# EAGLE design Power Switching Circuit rev4 (EAGLE 9.6.2)

## Sheet 1 of 2
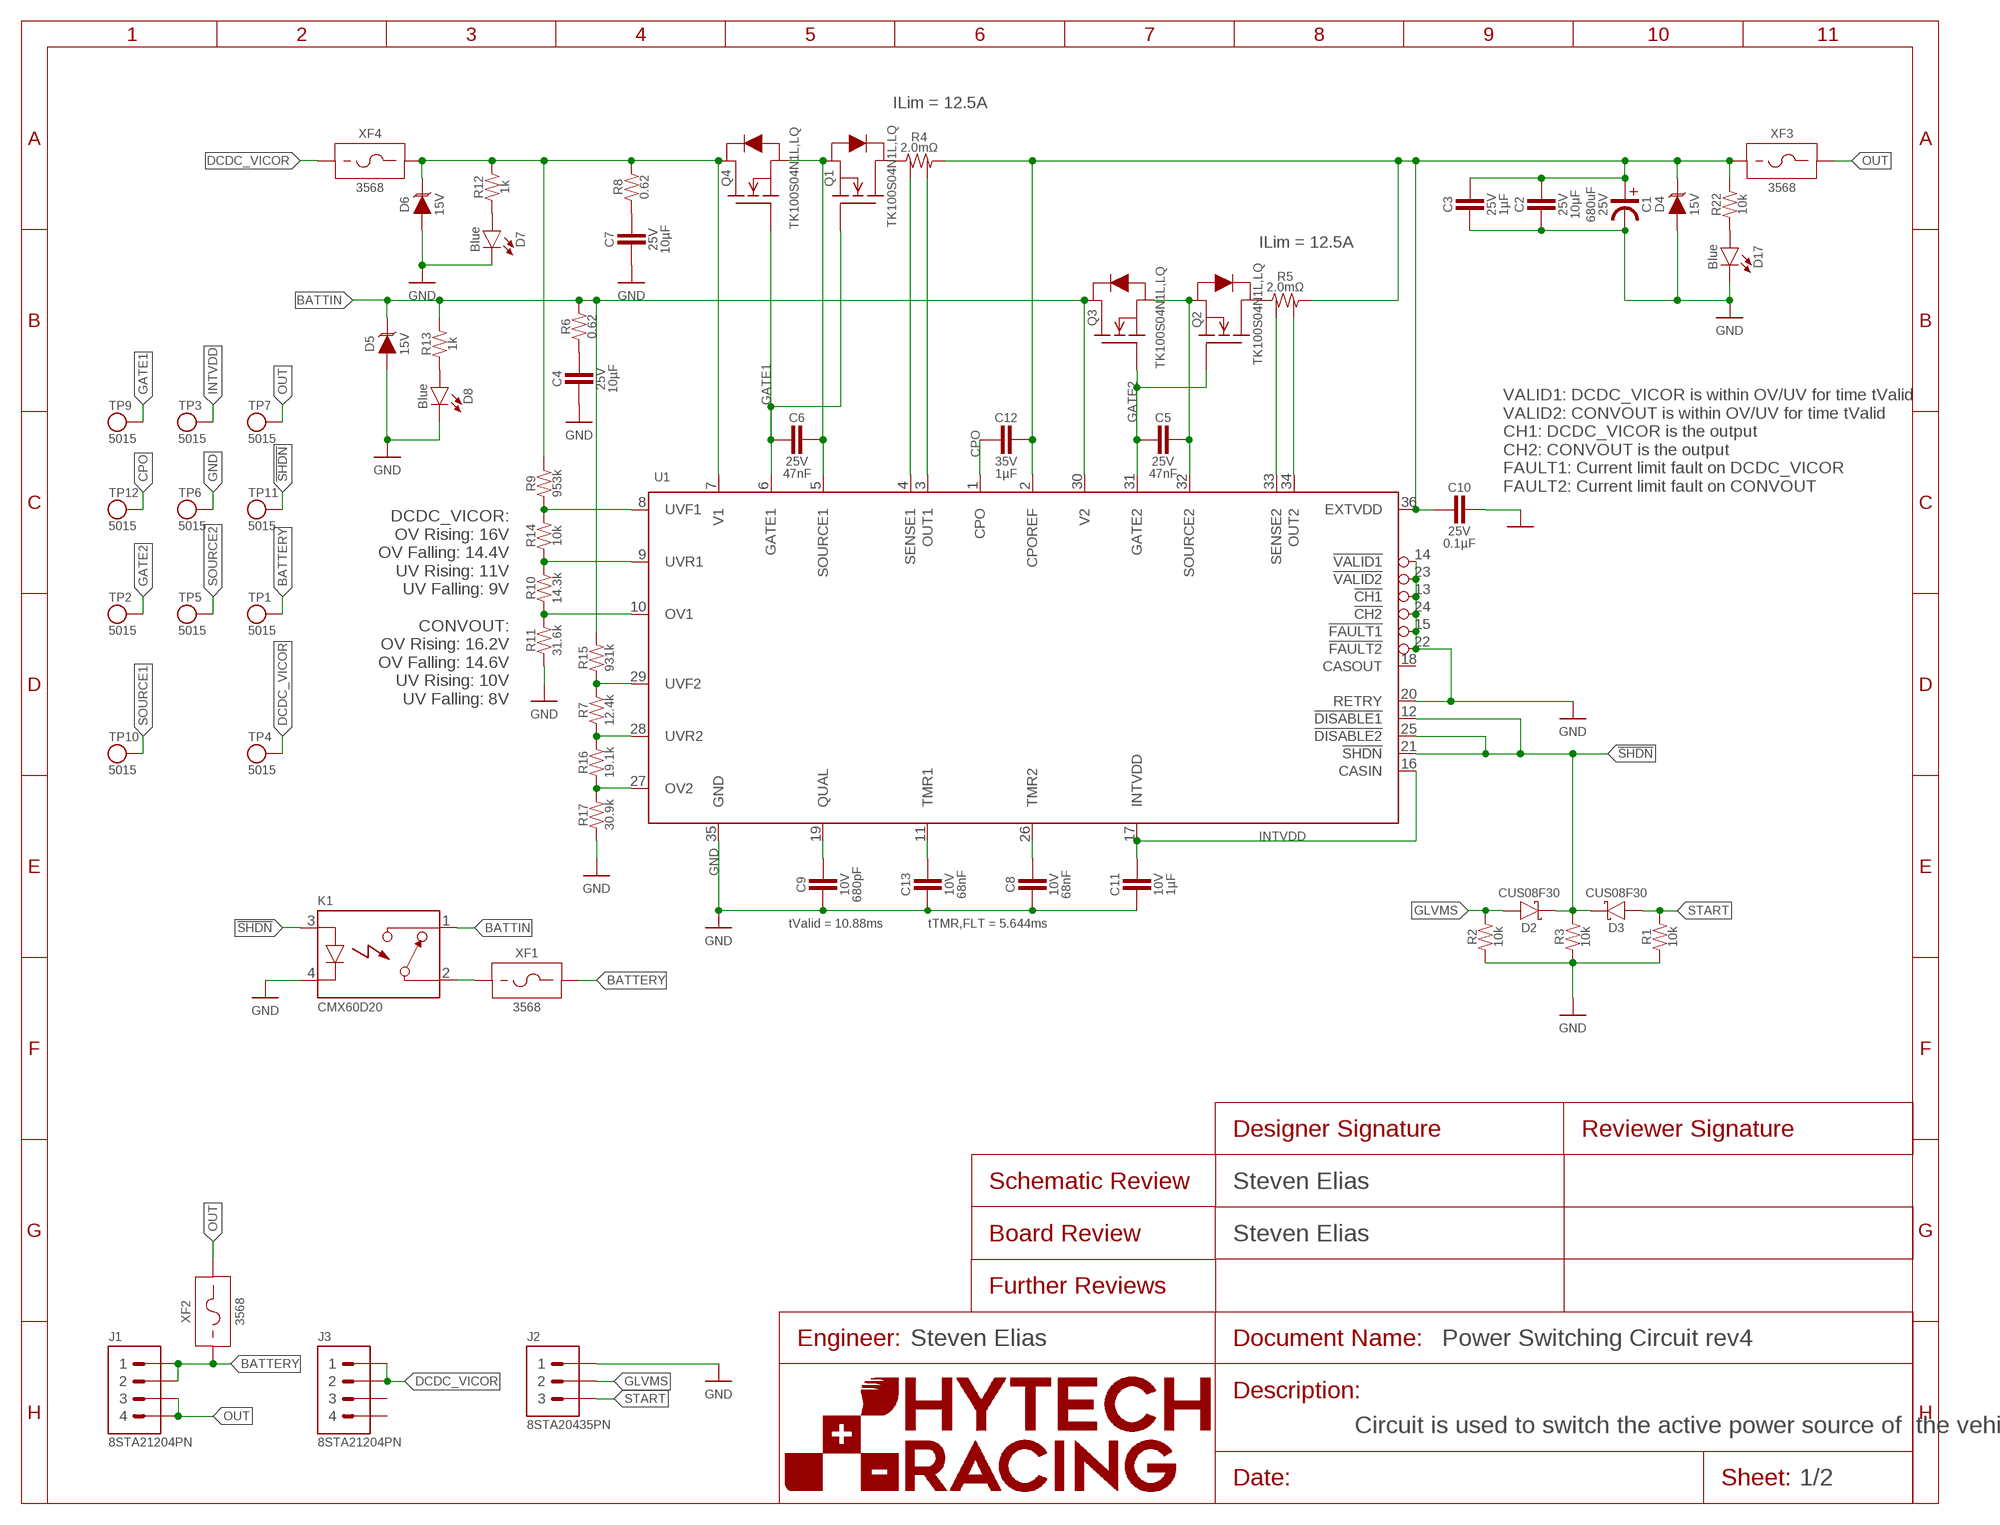
[diagram p0: schematic, sheet 1]
FRAME1 (FRAME): DESCRIPTION_1: Circuit is used to switch the active power source of the vehicle from the GLV battery to the accumulator; DESIGNER_BOARD: Steven Elias; DESIGNER_SCHEMATIC: Steven Elias; ENGINEER: Steven Elias

### Parts
C1  EEUFP1E681  [EEUFP1E*]
C2  CAPACITOR_0603_25V_10UF  [0603-CAP]
C3  CAPACITOR_0603_25V_1UF  [0603-CAP]
C4  CAPACITOR_0603_25V_10UF  [0603-CAP]
C5  CAPACITOR_0603_25V_47NF  [0603-CAP]
C6  CAPACITOR_0603_25V_47NF  [0603-CAP]
C7  CAPACITOR_0603_25V_10UF  [0603-CAP]
C8  CAPACITOR_0603_10V_68NF  [0603-CAP]
C9  CAPACITOR_0603_10V_680PF  [0603-CAP]
C10  CAPACITOR_0603_25V_0.1UF  [0603-CAP]
C11  CAPACITOR_0603_10V_1UF  [0603-CAP]
C12  CAPACITOR_0603_35V_1UF  [0603-CAP]
C13  CAPACITOR_0603_10V_68NF  [0603-CAP]
D2  SCHOTTKY_SOD323_30V  [SOD-323]
D3  SCHOTTKY_SOD323_30V  [SOD-323]
D4  TVS_15V  [SOT-23]
D5  TVS_15V  [SOT-23]
D6  TVS_15V  [SOT-23]
D7  LED_0603_BLUE  [0603-LED]
D8  LED_0603_BLUE  [0603-LED]
D17  LED_0603_BLUE  [0603-LED]
J1  CONNECTOR-4_SOURIAU_  [SOURIAU_12-04]
J2  CONNECTOR-3_8STA20435PN  [SOURIAU_04-35]
J3  CONNECTOR-4_SOURIAU_  [SOURIAU_12-04]
K1  RELAY_SOLIDSTATE_NO_CMX60D20  [CRYDOM_CMX]
Q1  TRANSISTOR_N_MOS_2-7K1S_TK100S04N1LLQ  [DPAK(2-7K1S)]
Q2  TRANSISTOR_N_MOS_2-7K1S_TK100S04N1LLQ  [DPAK(2-7K1S)]
Q3  TRANSISTOR_N_MOS_2-7K1S_TK100S04N1LLQ  [DPAK(2-7K1S)]
Q4  TRANSISTOR_N_MOS_2-7K1S_TK100S04N1LLQ  [DPAK(2-7K1S)]
R1  RESISTOR_0603_10K  [0603-RES]
R2  RESISTOR_0603_10K  [0603-RES]
R3  RESISTOR_0603_10K  [0603-RES]
R4  RESISTOR_SENSE__WSL40262L000FEB  [4026]
R5  RESISTOR_SENSE__WSL40262L000FEB  [4026]
R6  RESISTOR_0805_0.62  [0805-RES]
R7  RESISTOR_0603_12.4K  [0603-RES]
R8  RESISTOR_0805_0.62  [0805-RES]
R9  RESISTOR_0805_953K  [0805-RES]
R10  RESISTOR_0805_14.3K  [0805-RES]
R11  RESISTOR_0805_31.6K  [0805-RES]
R12  RESISTOR_0603_1K  [0603-RES]
R13  RESISTOR_0603_1K  [0603-RES]
R14  RESISTOR_0603_10K  [0603-RES]
R15  RESISTOR_0805_931K  [0805-RES]
R16  RESISTOR_0805_19.1K  [0805-RES]
R17  RESISTOR_0603_30.9K  [0603-RES]
R22  RESISTOR_0603_10K  [0603-RES]
TP1  TEST_POINT  [5015]
TP2  TEST_POINT  [5015]
TP3  INTVDD  TEST_POINT  [5015]
TP4  TEST_POINT  [5015]
TP5  TEST_POINT  [5015]
TP6  TEST_POINT  [5015]
TP7  TEST_POINT  [5015]
TP9  TEST_POINT  [5015]
TP10  TEST_POINT  [5015]
TP11  TEST_POINT  [5015]
TP12  TEST_POINT  [5015]
U1  LTC4421  [SSOP-36]
XF1  FUSE_HOLDER_MINIBLADEPTH  [3568]
XF2  FUSE_HOLDER_MINIBLADEPTH  [3568]
XF3  FUSE_HOLDER_MINIBLADEPTH  [3568]
XF4  FUSE_HOLDER_MINIBLADEPTH  [3568]

### Nets
!SHDN: D2.C D3.C K1.3(CONTROL+) R3.2 TP11.1 U1.12(!DISABLE1) U1.21(!SHDN) U1.25(!DISABLE2)
BATTERY: J1.1 J1.2 TP1.1 XF1.3 XF1.4 XF2.1 XF2.2
BATTIN: D5.3(C) K1.1(CONTACT2) Q3.2(D) R6.2 R13.2 R15.2 U1.30(V2)
CPO: C12.2 TP12.1 U1.1(CPO)
DCDC_VICOR: J3.1 J3.2 TP4.1 XF4.1 XF4.2
DCDC_VICORPREMOS: D6.3(C) Q4.2(D) R8.2 R9.2 R12.2 U1.7(V1) XF4.3 XF4.4
GATE1: C6.2 Q1.1(G) Q4.1(G) TP9.1 U1.6(GATE1)
GATE2: C5.2 Q2.1(G) Q3.1(G) TP2.1 U1.31(GATE2)
GLVMS: D2.A J2.B R2.2
GND: C1.P$2(MINUS) C2.2 C3.2 C4.2 C7.2 C8.2 C9.2 C10.1 C11.2 C13.2 D4.1(A) D5.1(A) D6.1(A) D7.1(C) D8.1(C) D17.1(C) J2.A K1.4(CONTROL-) R1.1 R2.1 R3.1 R11.1 R17.1 TP6.1 U1.13(!CH1) U1.14(!VALID1) U1.15(!FAULT1) U1.20(RETRY) U1.22(!FAULT2) U1.23(!VALID2) U1.24(!CH2) U1.35(GND)
INTVDD: C11.1 TP3.1 U1.16(CASIN) U1.17(INTVDD)
N$1: C9.1 U1.19(QUAL)
N$2: C13.1 U1.11(TMR1)
N$3: C8.1 U1.26(TMR2)
N$4: C4.1 R6.1
N$5: D17.2(A) R22.1
N$6: D8.2(A) R13.1
N$7: D7.2(A) R12.1
N$12: K1.2(CONTACT1) XF1.1 XF1.2
N$18: R5.3 U1.33(SENSE2)
N$20: R5.4 U1.34(OUT2)
N$22: C7.1 R8.1
N$23: R4.3 U1.4(SENSE1)
N$24: R10.2 R14.1 U1.9(UVR1)
N$25: R10.1 R11.2 U1.10(OV1)
N$26: R7.2 R15.1 U1.29(UVF2)
N$27: R7.1 R16.2 U1.28(UVR2)
N$28: R16.1 R17.2 U1.27(OV2)
N$30: Q2.2(D) R5.1
N$31: R4.4 U1.3(OUT1)
N$33: Q1.2(D) R4.1
OUT: J1.3 J1.4 TP7.1 XF2.3 XF2.4 XF3.3 XF3.4
OUTPREFUSE: C1.P$1(PLUS) C2.1 C3.1 C10.2 C12.1 D4.3(C) R4.2 R5.2 R22.2 U1.2(CPOREF) U1.36(EXTVDD) XF3.1 XF3.2
SOURCE1: C6.1 Q1.3(S) Q4.3(S) TP10.1 U1.5(SOURCE1)
SOURCE2: C5.1 Q2.3(S) Q3.3(S) TP5.1 U1.32(SOURCE2)
START: D3.A J2.C R1.2
UVF1: R9.1 R14.2 U1.8(UVF1)
Unconnected: J3.3 J3.4 U1.18(CASOUT)

### Notes on the sheet
- ILim = 12.5A
- ILim = 12.5A
- VALID1: DCDC_VICOR is within OV/UV for time tValid
  VALID2: CONVOUT is within OV/UV for time tValid
  CH1: DCDC_VICOR is the output
  CH2: CONVOUT is the output
  FAULT1: Current limit fault on DCDC_VICOR
  FAULT2: Current limit fault on CONVOUT
- DCDC_VICOR:
  OV Rising: 16V
  OV Falling: 14.4V
  UV Rising: 11V
  UV Falling: 9V
  
  CONVOUT:
  OV Rising: 16.2V
  OV Falling: 14.6V
  UV Rising: 10V
  UV Falling: 8V
- tValid = 10.88ms | tTMR,FLT = 5.644ms

## Sheet 2 of 2
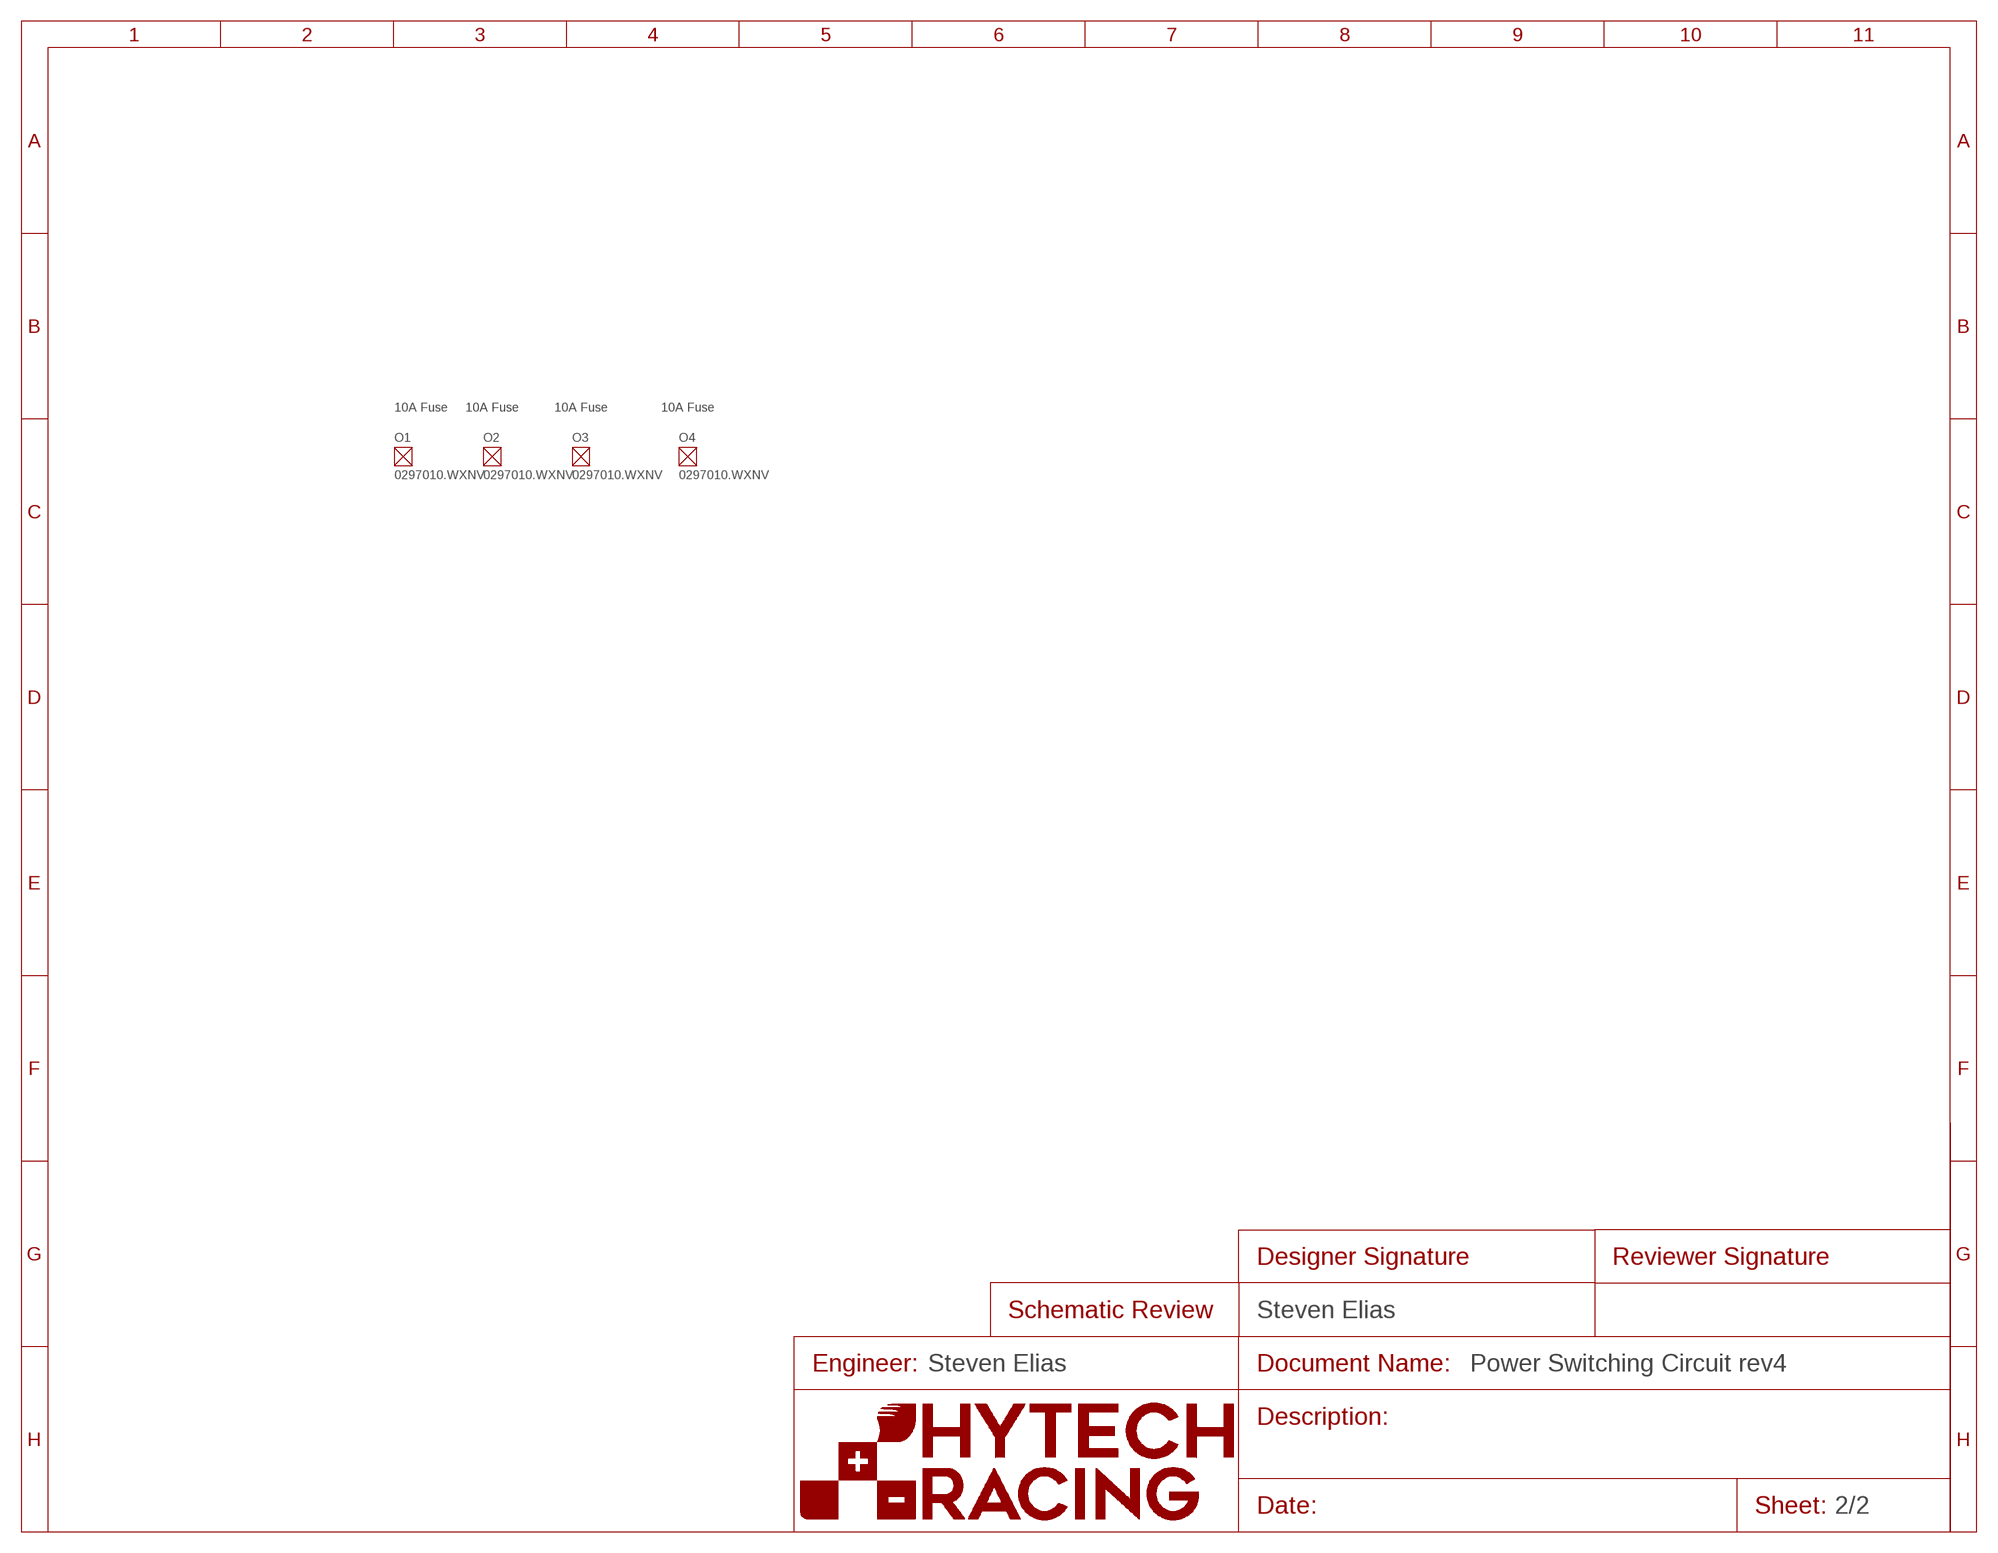
[diagram p1: schematic, sheet 2]
FRAME2 (FRAME_SCHEMATIC_ONLY): DESIGNER_SCHEMATIC: Steven Elias; ENGINEER: Steven Elias
O1 (FUSE_MINI_BLADE_10): DKPN: F991-ND; MANUFACTURER: Littelfuse Inc.; MOPN: 576-0297010.WXNV; MPN: 0297010.WXNV
O2 (FUSE_MINI_BLADE_10): DKPN: F991-ND; MANUFACTURER: Littelfuse Inc.; MOPN: 576-0297010.WXNV; MPN: 0297010.WXNV
O3 (FUSE_MINI_BLADE_10): DKPN: F991-ND; MANUFACTURER: Littelfuse Inc.; MOPN: 576-0297010.WXNV; MPN: 0297010.WXNV
O4 (FUSE_MINI_BLADE_10): DKPN: F991-ND; MANUFACTURER: Littelfuse Inc.; MOPN: 576-0297010.WXNV; MPN: 0297010.WXNV

### Notes on the sheet
- 10A Fuse | 10A Fuse | 10A Fuse | 10A Fuse

## Library data of the parts
C1 = HyTechDevicesTemp:EEUFP1E*: EEUFP1E Aluminum Electrolytic Capacitor Datasheet <https://www.mouser.com/datasheet/2/315/RDF0000C1260-1391675.pdf>; CAPACITANCE: 680uF; DKPN: P123947-ND; ESR: 0.068; MANUFACTURER: Panasonic Electronic Components; MOPN: 667-EEU-FP1E681; MPN: EEU-FP1E681; TOLERANCE: 20%; VOLTAGE: 25V
C2 C4 C7 = HyTechDevices:CAPACITOR_?_*: Capacitor, Non-Polarized VJ...1BC Series Datasheet Samsung Datasheet Walsin Datasheet GRM188R61A226ME15D GRM188R61E106MA73D 885012006013 2220Y6300105KXTWS2 Yageo Class 2, X5R TDK C Series AVX Automotive MLCC KEMET X7R Series Kyocera AVX; CAPACITANCE: 10µF; DKPN: 490-7202-1-ND; MANUFACTURER: Murata Electronics; MOPN: 81-GRM188R61E106MA3D; MPN: GRM188R61E106MA73D; TOLERANCE: 20%; VOLTAGE: 25V
C3 = HyTechDevices:CAPACITOR_?_*: Capacitor, Non-Polarized VJ...1BC Series Datasheet Samsung Datasheet Walsin Datasheet GRM188R61A226ME15D GRM188R61E106MA73D 885012006013 2220Y6300105KXTWS2 Yageo Class 2, X5R TDK C Series AVX Automotive MLCC KEMET X7R Series Kyocera AVX; CAPACITANCE: 1µF; DKPN: 1276-1184-1-ND; MANUFACTURER: Samsung Electro-Mechanics; MOPN: 187-CL10B105KA8NNNC; MPN: CL10B105KA8NNNC; TOLERANCE: 10%; VOLTAGE: 25V
C5 C6 = HyTechDevices:CAPACITOR_?_*: Capacitor, Non-Polarized VJ...1BC Series Datasheet Samsung Datasheet Walsin Datasheet GRM188R61A226ME15D GRM188R61E106MA73D 885012006013 2220Y6300105KXTWS2 Yageo Class 2, X5R TDK C Series AVX Automotive MLCC KEMET X7R Series Kyocera AVX; CAPACITANCE: 47nF; DKPN: 478-6340-1-ND; MANUFACTURER: Kyocera AVX; MOPN: 581-06033C473K42ZA; MPN: 06033C473K4Z2A; TOLERANCE: 10%; VOLTAGE: 25V
C8 C13 = HyTechDevices:CAPACITOR_?_*: Capacitor, Non-Polarized VJ...1BC Series Datasheet Samsung Datasheet Walsin Datasheet GRM188R61A226ME15D GRM188R61E106MA73D 885012006013 2220Y6300105KXTWS2 Yageo Class 2, X5R TDK C Series AVX Automotive MLCC KEMET X7R Series Kyocera AVX; CAPACITANCE: 68nF; DKPN: 399-C0603C683K8RAC7867CT-ND; MANUFACTURER: KEMET; MOPN: 80-C0603C683K8R; MPN: C0603C683K8RACTU; TOLERANCE: 10%; VOLTAGE: 10V
C9 = HyTechDevices:CAPACITOR_?_*: Capacitor, Non-Polarized VJ...1BC Series Datasheet Samsung Datasheet Walsin Datasheet GRM188R61A226ME15D GRM188R61E106MA73D 885012006013 2220Y6300105KXTWS2 Yageo Class 2, X5R TDK C Series AVX Automotive MLCC KEMET X7R Series Kyocera AVX; CAPACITANCE: 680pF; DKPN: 732-7757-1-ND; MANUFACTURER: Würth Elektronik; MOPN: 710-885012006013; MPN: 885012006013; TOLERANCE: 5%; VOLTAGE: 10V
C10 = HyTechDevices:CAPACITOR_?_*: Capacitor, Non-Polarized VJ...1BC Series Datasheet Samsung Datasheet Walsin Datasheet GRM188R61A226ME15D GRM188R61E106MA73D 885012006013 2220Y6300105KXTWS2 Yageo Class 2, X5R TDK C Series AVX Automotive MLCC KEMET X7R Series Kyocera AVX; CAPACITANCE: 0.1µF; DKPN: 1276-1006-1-ND; MANUFACTURER: Samsung Electro-Mechanics; MOPN: 187-CL10B104KA8NNNC; MPN: CL10B104KA8NNNC; TOLERANCE: 10%; VOLTAGE: 25V
C11 = HyTechDevices:CAPACITOR_?_*: Capacitor, Non-Polarized VJ...1BC Series Datasheet Samsung Datasheet Walsin Datasheet GRM188R61A226ME15D GRM188R61E106MA73D 885012006013 2220Y6300105KXTWS2 Yageo Class 2, X5R TDK C Series AVX Automotive MLCC KEMET X7R Series Kyocera AVX; CAPACITANCE: 1µF; DKPN: 311-1796-1-ND; MANUFACTURER: Yageo; MOPN: 603-CC603KRX7R6BB105; MPN: CC0603KRX7R6BB105; TOLERANCE: 10%; VOLTAGE: 10V
C12 = HyTechDevices:CAPACITOR_?_*: Capacitor, Non-Polarized VJ...1BC Series Datasheet Samsung Datasheet Walsin Datasheet GRM188R61A226ME15D GRM188R61E106MA73D 885012006013 2220Y6300105KXTWS2 Yageo Class 2, X5R TDK C Series AVX Automotive MLCC KEMET X7R Series Kyocera AVX; CAPACITANCE: 1µF; DKPN: 445-173625-1-ND; MANUFACTURER: TDK Corporation; MOPN: 810-C1608X7R1V105KAE; MPN: C1608X7R1V105K080AE; TOLERANCE: 10%; VOLTAGE: 35V
D2 D3 = HyTechDevices:SCHOTTKY_?_*: CUS08F30 Shottky Diode Datasheet; CURRENT: 0.8A; DKPN: CUS08F30H3FTR-ND; MANUFACTURER: Toshiba Semiconductor and Storage; MOPN: 757-CUS08F30H3F; MPN: CUS08F30; VOLTAGE: 30V
D4-D6 = HyTechDevices:TVS_*: TVS Diode GSOT Datasheet; DKPN: GSOT15-E3-08CT-ND; MANUFACTURER: Vishay General Semiconductor - Diodes Division; MOPN: 78-GSOT15-E3-08; MPN: GSOT15-E3-08; VOLTAGE: 15V
D7 D8 D17 = HyTechDevices:LED_?_*: LED 0603 Blue Green Orange Red White Yellow 2835 (Series not on Digikey) Lumiled LUXEON 2835 Color Line; COLOR: Blue; DKPN: 754-1789-1-ND; MANUFACTURER: Kingbright; MOPN: 604-APT1608VBC/D; MPN: APT1608VBC/D
J1 J3 = HyTechDevices:CONNECTOR-4_?_*; MANUFACTURER: Souriau; MPN: 8STA21204PN
J2 = HyTechDevices:CONNECTOR-3_?; MANUFACTURER: Souriau; MPN: 8STA20435PN
K1 = HyTechDevicesTemp:RELAY_SOLIDSTATE_NO_?*: Solid State Normally Open Relay Crydom CMX Series <https://www.mouser.com/datasheet/2/657/cmx_series_dc_pcb_mount-1370813.pdf>; DKPN: CC1666-ND; MANUFACTURER: Crydom; MOPN: 558-CMX60D20; MPN: CMX60D20
Q1-Q4 = HyTechDevices:TRANSISTOR_N_MOS_?_*: N-MOSFET PMV15ENEA Datasheet TK6P65W Datasheet SIR638ADP Datasheet; DKPN: TK100S04N1LLQCT-ND; MANUFACTURER: Toshiba Semiconductor and Storage; MOPN: 757-TK100S04N1LLQ; MPN: TK100S04N1L,LQ
R1-R3 R14 R22 = HyTechDevices:RESISTOR_?_*: Resistor PWR163 Series <https://www.mouser.com/datasheet/2/54/pwr163-777985.pdf> AC Series <https://www.mouser.com/datasheet/2/447/Yageo_PYu_AC_51_RoHS_L_7_1714230-1874691.pdf> PU Series <https://www.mouser.com/datasheet/2/447/PYu-PU_51_RoHS_L_6-1504619.pdf> ERA Series <https://www.mouser.com/datasheet/2/315/AOA0000C307-1149632.pdf> PWR263 Series <https://www.mouser.com/datasheet/2/54/pwr263s_35-778069.pdf> RC Series <https://www.mouser.com/datasheet/2/447/Yageo_03_18_2021_PYu_RC_Group_51_RoHS_L_11-2199992.pdf> ERJ PB3, PB6 Series <https://www.mouser.com/datasheet/2/315/AOA0000C328-1530132.pdf> ERJ PA2, P03, PA3, P06, P08, P14 Series <https://www.mouser.com/datasheet/2/315/AOA0000C331-1141874.pdf> TE Connectivity/Holsworthy RN73 Series <https://www.mouser.com/datasheet/2/418/4/NG_DS_1773270_M-604713.pdf> Vishay Dale D/CRCW e3 <https://www.mouser.com/datasheet/2/427/dcrcwe3-1762152.pdf>; DKPN: 311-10.0KHRCT-ND; MANUFACTURER: Yageo; MOPN: 603-RC0603FR-0710KL; MPN: RC0603FR-0710KL; POWER: 0.1W; RESISTANCE: 10k; TOLERANCE: 1%; VOLTAGE_CONTINUOUS: 31.62V; VOLTAGE_MAX: 75V
R4 R5 = HyTechDevicesTemp:RESISTOR_SENSE_?_*: Vishay Dale Current Sense Resistor Datasheet <https://www.mouser.com/datasheet/2/427/VISH_S_A0011243377_1-2572030.pdf>; DKPN: WSLR-.002CT-ND; MANUFACTURER: Vishay Dale; MOPN: 71-WSL40262L000FEB; MPN: WSL40262L000FEB; POWER: 3W; RESISTANCE: 2.0mΩ; TOLERANCE: 1%; VOLTAGE: 0.077V
R6 R8 = HyTechDevices:RESISTOR_?_*: Resistor PWR163 Series <https://www.mouser.com/datasheet/2/54/pwr163-777985.pdf> AC Series <https://www.mouser.com/datasheet/2/447/Yageo_PYu_AC_51_RoHS_L_7_1714230-1874691.pdf> PU Series <https://www.mouser.com/datasheet/2/447/PYu-PU_51_RoHS_L_6-1504619.pdf> ERA Series <https://www.mouser.com/datasheet/2/315/AOA0000C307-1149632.pdf> PWR263 Series <https://www.mouser.com/datasheet/2/54/pwr263s_35-778069.pdf> RC Series <https://www.mouser.com/datasheet/2/447/Yageo_03_18_2021_PYu_RC_Group_51_RoHS_L_11-2199992.pdf> ERJ PB3, PB6 Series <https://www.mouser.com/datasheet/2/315/AOA0000C328-1530132.pdf> ERJ PA2, P03, PA3, P06, P08, P14 Series <https://www.mouser.com/datasheet/2/315/AOA0000C331-1141874.pdf> TE Connectivity/Holsworthy RN73 Series <https://www.mouser.com/datasheet/2/418/4/NG_DS_1773270_M-604713.pdf> Vishay Dale D/CRCW e3 <https://www.mouser.com/datasheet/2/427/dcrcwe3-1762152.pdf>; DKPN: 311-.62SCT-ND; MANUFACTURER: Yageo; MOPN: 603-RL0805FR-070R62L; MPN: RL0805FR-070R62L; POWER: 0.125W; RESISTANCE: 0.62; TOLERANCE: 1%; VOLTAGE_CONTINUOUS: 0.28V; VOLTAGE_MAX: 0.70V
R7 = HyTechDevices:RESISTOR_?_*: Resistor PWR163 Series <https://www.mouser.com/datasheet/2/54/pwr163-777985.pdf> AC Series <https://www.mouser.com/datasheet/2/447/Yageo_PYu_AC_51_RoHS_L_7_1714230-1874691.pdf> PU Series <https://www.mouser.com/datasheet/2/447/PYu-PU_51_RoHS_L_6-1504619.pdf> ERA Series <https://www.mouser.com/datasheet/2/315/AOA0000C307-1149632.pdf> PWR263 Series <https://www.mouser.com/datasheet/2/54/pwr263s_35-778069.pdf> RC Series <https://www.mouser.com/datasheet/2/447/Yageo_03_18_2021_PYu_RC_Group_51_RoHS_L_11-2199992.pdf> ERJ PB3, PB6 Series <https://www.mouser.com/datasheet/2/315/AOA0000C328-1530132.pdf> ERJ PA2, P03, PA3, P06, P08, P14 Series <https://www.mouser.com/datasheet/2/315/AOA0000C331-1141874.pdf> TE Connectivity/Holsworthy RN73 Series <https://www.mouser.com/datasheet/2/418/4/NG_DS_1773270_M-604713.pdf> Vishay Dale D/CRCW e3 <https://www.mouser.com/datasheet/2/427/dcrcwe3-1762152.pdf>; DKPN: P20096CT-ND; MANUFACTURER: Panasonic Electronic Components; MOPN: 667-ERJ-PB3B1242V; MPN: ERJ-PB3B1242V; POWER: 0.2W; RESISTANCE: 12.4k; TOLERANCE: 0.1%; VOLTAGE_CONTINUOUS: 49.8V; VOLTAGE_MAX: 150V
R9 = HyTechDevices:RESISTOR_?_*: Resistor PWR163 Series <https://www.mouser.com/datasheet/2/54/pwr163-777985.pdf> AC Series <https://www.mouser.com/datasheet/2/447/Yageo_PYu_AC_51_RoHS_L_7_1714230-1874691.pdf> PU Series <https://www.mouser.com/datasheet/2/447/PYu-PU_51_RoHS_L_6-1504619.pdf> ERA Series <https://www.mouser.com/datasheet/2/315/AOA0000C307-1149632.pdf> PWR263 Series <https://www.mouser.com/datasheet/2/54/pwr263s_35-778069.pdf> RC Series <https://www.mouser.com/datasheet/2/447/Yageo_03_18_2021_PYu_RC_Group_51_RoHS_L_11-2199992.pdf> ERJ PB3, PB6 Series <https://www.mouser.com/datasheet/2/315/AOA0000C328-1530132.pdf> ERJ PA2, P03, PA3, P06, P08, P14 Series <https://www.mouser.com/datasheet/2/315/AOA0000C331-1141874.pdf> TE Connectivity/Holsworthy RN73 Series <https://www.mouser.com/datasheet/2/418/4/NG_DS_1773270_M-604713.pdf> Vishay Dale D/CRCW e3 <https://www.mouser.com/datasheet/2/427/dcrcwe3-1762152.pdf>; DKPN: P953KCCT-ND; MANUFACTURER: Panasonic Electronic Components; MOPN: 667-ERJ-6ENF9533V; MPN: ERJ-6ENF9533V; POWER: 0.125W; RESISTANCE: 953k; TOLERANCE: 1%; VOLTAGE_CONTINUOUS: 150V; VOLTAGE_MAX: 200V
R10 = HyTechDevices:RESISTOR_?_*: Resistor PWR163 Series <https://www.mouser.com/datasheet/2/54/pwr163-777985.pdf> AC Series <https://www.mouser.com/datasheet/2/447/Yageo_PYu_AC_51_RoHS_L_7_1714230-1874691.pdf> PU Series <https://www.mouser.com/datasheet/2/447/PYu-PU_51_RoHS_L_6-1504619.pdf> ERA Series <https://www.mouser.com/datasheet/2/315/AOA0000C307-1149632.pdf> PWR263 Series <https://www.mouser.com/datasheet/2/54/pwr263s_35-778069.pdf> RC Series <https://www.mouser.com/datasheet/2/447/Yageo_03_18_2021_PYu_RC_Group_51_RoHS_L_11-2199992.pdf> ERJ PB3, PB6 Series <https://www.mouser.com/datasheet/2/315/AOA0000C328-1530132.pdf> ERJ PA2, P03, PA3, P06, P08, P14 Series <https://www.mouser.com/datasheet/2/315/AOA0000C331-1141874.pdf> TE Connectivity/Holsworthy RN73 Series <https://www.mouser.com/datasheet/2/418/4/NG_DS_1773270_M-604713.pdf> Vishay Dale D/CRCW e3 <https://www.mouser.com/datasheet/2/427/dcrcwe3-1762152.pdf>; DKPN: P14.3KCCT-ND; MANUFACTURER: Panasonic Electronic Components; MOPN: 667-ERJ-6ENF1432V; MPN: ERJ-6ENF1432V; POWER: 0.125W; RESISTANCE: 14.3k; TOLERANCE: 1%; VOLTAGE_CONTINUOUS: 150V; VOLTAGE_MAX: 200V
R11 = HyTechDevices:RESISTOR_?_*: Resistor PWR163 Series <https://www.mouser.com/datasheet/2/54/pwr163-777985.pdf> AC Series <https://www.mouser.com/datasheet/2/447/Yageo_PYu_AC_51_RoHS_L_7_1714230-1874691.pdf> PU Series <https://www.mouser.com/datasheet/2/447/PYu-PU_51_RoHS_L_6-1504619.pdf> ERA Series <https://www.mouser.com/datasheet/2/315/AOA0000C307-1149632.pdf> PWR263 Series <https://www.mouser.com/datasheet/2/54/pwr263s_35-778069.pdf> RC Series <https://www.mouser.com/datasheet/2/447/Yageo_03_18_2021_PYu_RC_Group_51_RoHS_L_11-2199992.pdf> ERJ PB3, PB6 Series <https://www.mouser.com/datasheet/2/315/AOA0000C328-1530132.pdf> ERJ PA2, P03, PA3, P06, P08, P14 Series <https://www.mouser.com/datasheet/2/315/AOA0000C331-1141874.pdf> TE Connectivity/Holsworthy RN73 Series <https://www.mouser.com/datasheet/2/418/4/NG_DS_1773270_M-604713.pdf> Vishay Dale D/CRCW e3 <https://www.mouser.com/datasheet/2/427/dcrcwe3-1762152.pdf>; DKPN: 541-31.6KSCT-ND; MANUFACTURER: Vishay Dale; MOPN: 71-CRCW060331K6FKEAH; MPN: CRCW060331K6FKEAHP; POWER: 0.33W; RESISTANCE: 31.6k; TOLERANCE: 1%; VOLTAGE_CONTINUOUS: 150V; VOLTAGE_MAX: 200V
R12 R13 = HyTechDevices:RESISTOR_?_*: Resistor PWR163 Series <https://www.mouser.com/datasheet/2/54/pwr163-777985.pdf> AC Series <https://www.mouser.com/datasheet/2/447/Yageo_PYu_AC_51_RoHS_L_7_1714230-1874691.pdf> PU Series <https://www.mouser.com/datasheet/2/447/PYu-PU_51_RoHS_L_6-1504619.pdf> ERA Series <https://www.mouser.com/datasheet/2/315/AOA0000C307-1149632.pdf> PWR263 Series <https://www.mouser.com/datasheet/2/54/pwr263s_35-778069.pdf> RC Series <https://www.mouser.com/datasheet/2/447/Yageo_03_18_2021_PYu_RC_Group_51_RoHS_L_11-2199992.pdf> ERJ PB3, PB6 Series <https://www.mouser.com/datasheet/2/315/AOA0000C328-1530132.pdf> ERJ PA2, P03, PA3, P06, P08, P14 Series <https://www.mouser.com/datasheet/2/315/AOA0000C331-1141874.pdf> TE Connectivity/Holsworthy RN73 Series <https://www.mouser.com/datasheet/2/418/4/NG_DS_1773270_M-604713.pdf> Vishay Dale D/CRCW e3 <https://www.mouser.com/datasheet/2/427/dcrcwe3-1762152.pdf>; DKPN: 311-1.00KHRCT-ND; MANUFACTURER: Yageo; MOPN: 603-RC0603FR-071KL; MPN: RC0603FR-071KL; POWER: 0.1W; RESISTANCE: 1k; TOLERANCE: 1%; VOLTAGE_CONTINUOUS: 10.00V; VOLTAGE_MAX: 75V
R15 = HyTechDevices:RESISTOR_?_*: Resistor PWR163 Series <https://www.mouser.com/datasheet/2/54/pwr163-777985.pdf> AC Series <https://www.mouser.com/datasheet/2/447/Yageo_PYu_AC_51_RoHS_L_7_1714230-1874691.pdf> PU Series <https://www.mouser.com/datasheet/2/447/PYu-PU_51_RoHS_L_6-1504619.pdf> ERA Series <https://www.mouser.com/datasheet/2/315/AOA0000C307-1149632.pdf> PWR263 Series <https://www.mouser.com/datasheet/2/54/pwr263s_35-778069.pdf> RC Series <https://www.mouser.com/datasheet/2/447/Yageo_03_18_2021_PYu_RC_Group_51_RoHS_L_11-2199992.pdf> ERJ PB3, PB6 Series <https://www.mouser.com/datasheet/2/315/AOA0000C328-1530132.pdf> ERJ PA2, P03, PA3, P06, P08, P14 Series <https://www.mouser.com/datasheet/2/315/AOA0000C331-1141874.pdf> TE Connectivity/Holsworthy RN73 Series <https://www.mouser.com/datasheet/2/418/4/NG_DS_1773270_M-604713.pdf> Vishay Dale D/CRCW e3 <https://www.mouser.com/datasheet/2/427/dcrcwe3-1762152.pdf>; DKPN: P20933CT-ND; MANUFACTURER: Panasonic Electronic Components; MOPN: 667-ERJ-PB6B9313V; MPN: ERJ-PB6B9313V; POWER: 0.25W; RESISTANCE: 931k; TOLERANCE: 0.1%; VOLTAGE_CONTINUOUS: 150V; VOLTAGE_MAX: 200V
R16 = HyTechDevices:RESISTOR_?_*: Resistor PWR163 Series <https://www.mouser.com/datasheet/2/54/pwr163-777985.pdf> AC Series <https://www.mouser.com/datasheet/2/447/Yageo_PYu_AC_51_RoHS_L_7_1714230-1874691.pdf> PU Series <https://www.mouser.com/datasheet/2/447/PYu-PU_51_RoHS_L_6-1504619.pdf> ERA Series <https://www.mouser.com/datasheet/2/315/AOA0000C307-1149632.pdf> PWR263 Series <https://www.mouser.com/datasheet/2/54/pwr263s_35-778069.pdf> RC Series <https://www.mouser.com/datasheet/2/447/Yageo_03_18_2021_PYu_RC_Group_51_RoHS_L_11-2199992.pdf> ERJ PB3, PB6 Series <https://www.mouser.com/datasheet/2/315/AOA0000C328-1530132.pdf> ERJ PA2, P03, PA3, P06, P08, P14 Series <https://www.mouser.com/datasheet/2/315/AOA0000C331-1141874.pdf> TE Connectivity/Holsworthy RN73 Series <https://www.mouser.com/datasheet/2/418/4/NG_DS_1773270_M-604713.pdf> Vishay Dale D/CRCW e3 <https://www.mouser.com/datasheet/2/427/dcrcwe3-1762152.pdf>; DKPN: P19.1KCCT-ND; MANUFACTURER: Panasonic Electronic Components; MOPN: 667-ERJ-6ENF1912V; MPN: ERJ-6ENF1912V; POWER: 0.125W; RESISTANCE: 19.1k; TOLERANCE: 0.1%; VOLTAGE_CONTINUOUS: 150V; VOLTAGE_MAX: 200V
R17 = HyTechDevices:RESISTOR_?_*: Resistor PWR163 Series <https://www.mouser.com/datasheet/2/54/pwr163-777985.pdf> AC Series <https://www.mouser.com/datasheet/2/447/Yageo_PYu_AC_51_RoHS_L_7_1714230-1874691.pdf> PU Series <https://www.mouser.com/datasheet/2/447/PYu-PU_51_RoHS_L_6-1504619.pdf> ERA Series <https://www.mouser.com/datasheet/2/315/AOA0000C307-1149632.pdf> PWR263 Series <https://www.mouser.com/datasheet/2/54/pwr263s_35-778069.pdf> RC Series <https://www.mouser.com/datasheet/2/447/Yageo_03_18_2021_PYu_RC_Group_51_RoHS_L_11-2199992.pdf> ERJ PB3, PB6 Series <https://www.mouser.com/datasheet/2/315/AOA0000C328-1530132.pdf> ERJ PA2, P03, PA3, P06, P08, P14 Series <https://www.mouser.com/datasheet/2/315/AOA0000C331-1141874.pdf> TE Connectivity/Holsworthy RN73 Series <https://www.mouser.com/datasheet/2/418/4/NG_DS_1773270_M-604713.pdf> Vishay Dale D/CRCW e3 <https://www.mouser.com/datasheet/2/427/dcrcwe3-1762152.pdf>; DKPN: P20140CT-ND; MANUFACTURER: Panasonic Electronic Components; MOPN: 667-ERJ-PB3B3092V; MPN: ERJ-PB3B3092V; POWER: 0.25W; RESISTANCE: 30.9k; TOLERANCE: 0.1%; VOLTAGE_CONTINUOUS: 150V; VOLTAGE_MAX: 200V
TP1-TP7 TP9-TP12 = HyTechDevices:TEST_POINT: Test Point for Probing; DKPN: 36-5015CT-ND; MANUFACTURER: Keystone Electronics; MOPN: 534-5015; MPN: 5015
U1 = HyTechDevices:LTC4421: LTC4421 Dual Supply Prioritizer Datasheet; DKPN: 161-LTC4421CG#PBF-ND; MANUFACTURER: Analog Devices Inc.; MOPN: 584-LTC4421CG#PBF; MPN: LTC4421CG#PBF
XF1-XF4 = HyTechDevices:FUSE_HOLDER_*: Fuse Holder All PNs for the holder; if Miniblade Fuses needed, order separately. Mini-Blade PTH Mini-Blade SMD; DKPN: 36-3568-ND; FUSE_TYPE: MINI 297; MANUFACTURER: Keystone; MOPN: 534-3568; MPN: 3568

## Board
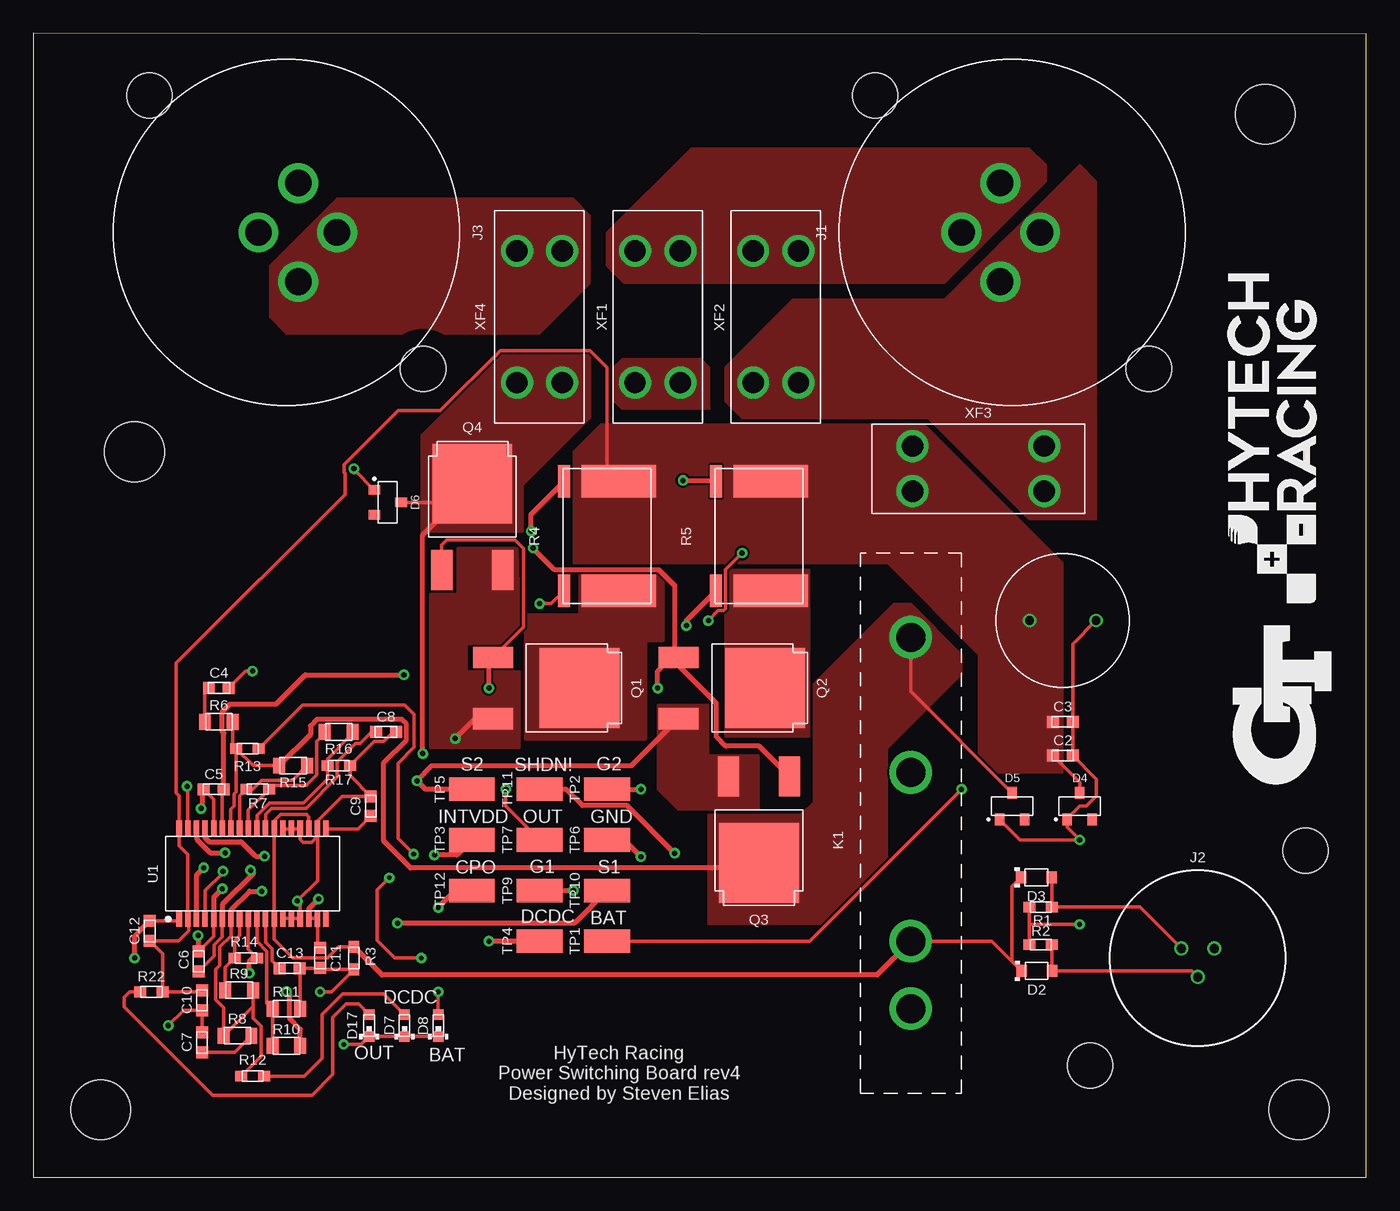
[diagram p2: board, top side]
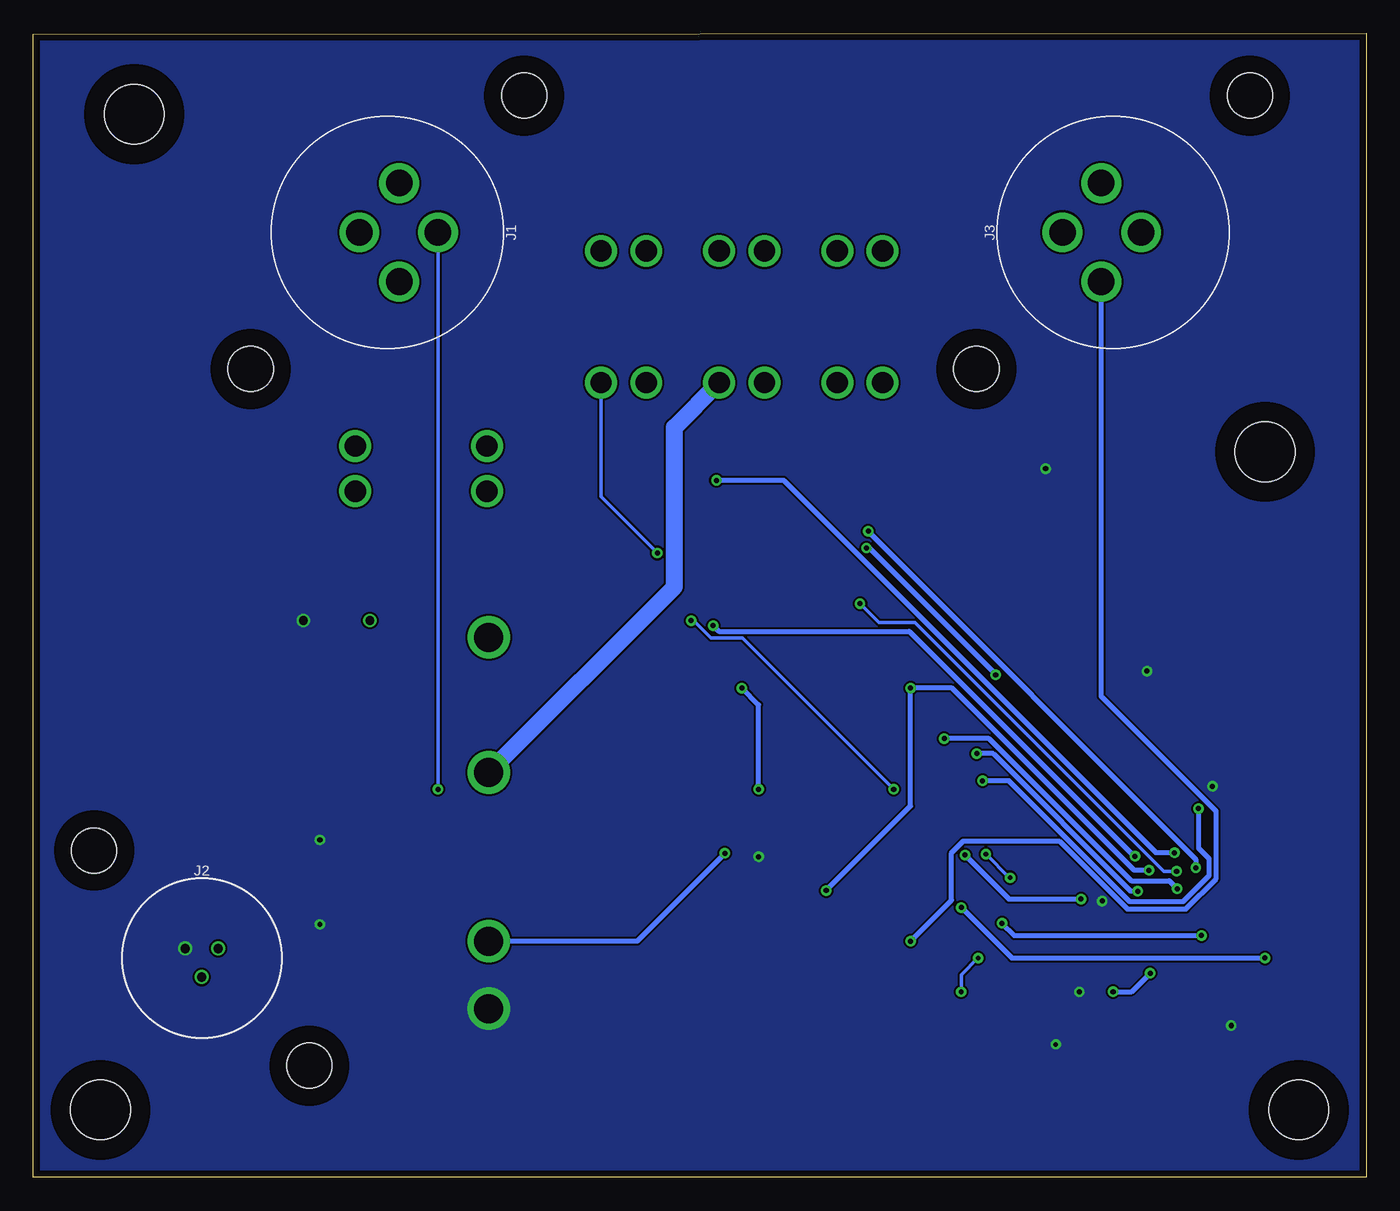
[diagram p3: board, bottom side, seen from below]

Size 100.31 x 86.11 mm. Coordinates in mm from the lower left corner, seen from the top.
Outline: 0,0 100.31,0 100.31,86.03 0,86.11 0,0
Copper layers (1*16): Top 0.035mm / dielectric 1.53mm / Bottom 0.035mm
Design rules "HyTech Default (2 Layer)": minimum track width 6mil, minimum drill 14mil, track to track 6mil, track to pad 6mil, pad to pad 6mil, via to via 20mil, smd to smd 6mil, copper to edge 20mil, drill to drill 21mil, minimum pad ring 7mil, minimum via ring 8mil, stop-mask expansion 6mil, vias tented up to drill 30mil, thermal gap 10mil

### Footprints (pad centres in the part's own frame; a part is rotated, then mirrored left to right if it is on the bottom)
EEUFP1E* = drill 0.65: P$1 -2.5,0; P$2 2.5,0
0603-CAP = smd 0.9 x 0.9: 1 -0.75,0; 2 0.75,0
SOD-323 = smd 0.8 x 0.9: A -1.15,0; C 1.15,0
SOT-23 = smd 0.711 x 0.889: 1 -0.94,-1.003; 2 0.94,-1.003; 3 0,1.003
0603-LED = smd 0.8 x 0.8: 1 -0.825,0; 2 0.825,0
SOURIAU_12-04 = drill 2: 1 0,3.81; 2 3.708,0.889; 3 0,-2.108; 4 -3.708,0.889 | hole 3.4: 10.288,10.288; -10.288,-10.288
SOURIAU_04-35 = drill 0.7: A 1.24,0.72; B 0,-1.43; C -1.24,0.72 | hole 3.4: 8.1,8.1; -8.1,-8.1
CRYDOM_CMX = drill 2.184: 1 13.97,0; 2 3.81,0; 3 -8.89,0; 4 -13.97,0
DPAK(2-7K1S) = smd 1.6 x 3: 1 -2.3,-3.5; 3 2.3,-3.5 | smd 6 x 6: 2 0,3
0603-RES = smd 0.9 x 0.8: 1 -0.85,0; 2 0.85,0
4026 = smd 2.438 x 5.588: 1 -4.115,-0.889; 2 4.115,-0.889 | smd 2.438 x 0.889: 3 -4.115,3.239; 4 4.115,3.239
0805-RES = smd 0.9 x 1.2: 1 -1.05,0; 2 1.05,0
5015 = smd 3.429 x 1.778: 1 0,0
SSOP-36 = smd 0.42 x 1.25: 1 -5.525,-3.375; 2 -4.875,-3.375; 3 -4.225,-3.375; 4 -3.575,-3.375; 5 -2.925,-3.375; 6 -2.275,-3.375; 7 -1.625,-3.375; 8 -0.975,-3.375; 9 -0.325,-3.375; 10 0.325,-3.375; 11 0.975,-3.375; 12 1.625,-3.375; 13 2.275,-3.375; 14 2.925,-3.375; 15 3.575,-3.375; 16 4.225,-3.375; 17 4.875,-3.375; 18 5.525,-3.375; 19 5.525,3.375; 20 4.875,3.375; 21 4.225,3.375; 22 3.575,3.375; 23 2.925,3.375; 24 2.275,3.375; 25 1.625,3.375; 26 0.975,3.375; 27 0.325,3.375; 28 -0.325,3.375; 29 -0.975,3.375; 30 -1.625,3.375; 31 -2.275,3.375; 32 -2.925,3.375; 33 -3.575,3.375; 34 -4.225,3.375; 35 -4.875,3.375; 36 -5.525,3.375
MOUNTING_M4 = hole 4.5: 0,0
3568 = drill 1.6: 1 -4.953,1.702; 2 -4.953,-1.702; 3 4.953,-1.702; 4 4.953,1.702

### Placement (x,y rotation side)
C1  77.47,41.91 0 top
C2  77.47,31.75 0 top
C3  77.47,34.29 0 top
C4  13.97,36.83 0 top
C5  13.59,29.21 0 top
C6  12.45,16.26 270 top
C7  12.7,10.16 90 top
C8  26.54,33.53 0 top
C9  25.4,27.94 90 top
C10  12.7,13.34 90 top
C11  21.59,16.51 270 top
C12  8.76,18.54 90 top
C13  19.3,15.75 0 top
D2  75.51,15.54 180 top
D3  75.49,22.58 180 top
D4  78.74,27.94 0 top
D5  73.66,27.94 0 top
D6  26.67,50.8 270 top
D7  27.94,11.43 90 top
D8  30.48,11.43 90 top
D17  25.27,11.43 90 top
J1  73.66,71.12 90 top
J2  87.63,16.51 0 top
J3  19.05,71.12 270 top
K1  66.04,26.67 90 top
Q1  38.1,36.83 270 top
Q2  52.07,36.83 270 top
Q3  54.61,26.67 180 top
Q4  33.05,49.2 0 top
R1  75.82,20.35 0 top
R2  75.82,17.53 0 top
R3  24.13,16.51 90 top
R4  43.18,48.26 90 top
R5  54.61,48.26 90 top
R6  13.97,34.29 0 top
R7  16.89,29.21 180 top
R8  15.37,10.67 180 top
R9  15.49,14.1 0 top
R10  19.05,9.91 0 top
R11  19.05,12.7 180 top
R12  16.51,7.62 180 top
R13  16.13,32.26 180 top
R14  16,16.51 180 top
R15  19.56,30.99 180 top
R16  22.99,33.53 180 top
R17  22.99,30.99 180 top
R22  8.89,13.97 0 top
TP1  43.18,17.78 0 top
TP2  43.18,29.21 0 top
TP3  33.02,25.4 0 top
TP4  38.1,17.78 0 top
TP5  33.02,29.21 0 top
TP6  43.18,25.4 0 top
TP7  38.1,25.4 0 top
TP9  38.1,21.59 0 top
TP10  43.18,21.59 0 top
TP11  38.1,29.21 0 top
TP12  33.02,21.59 0 top
U1  16.51,22.86 0 top
U$1  [LOGO_GT_MEDIUM]  93.98,35.56 90 top
U$2  [LOGO_HYTECH_MEDIUM]  96.52,43.18 90 top
U$3  [MOUNTING_M4]  7.62,54.61 0 top
U$4  [MOUNTING_M4]  5.08,5.08 0 top
U$5  [MOUNTING_M4]  92.71,80.01 0 top
U$6  [MOUNTING_M4]  95.25,5.08 0 top
XF1  46.99,64.77 90 top
XF2  55.88,64.77 270 top
XF3  71.12,53.34 0 top
XF4  38.1,64.77 270 top

### Tracks (layer width: path | path; a pad name or v marks a point on that pad's centre or on a via)
!SHDN  (via drill 0.38)
  Top 0.254: U1.21 20.73,27.14 20.57,27.3 18.62,27.3 18.14,26.82 U1.25 U1.12 18.14,17.93 19.54,16.53 22.16,16.53 22.98,17.36 R3.2 | 73.66,16.25 73.66,21.9 D3.C | K1.3 72.13,17.78 73.53,16.38 73.66,16.25 | 73.66,16.25 D2.C
  Top 0.381: R3.2 26.25,15.24 63.5,15.24 K1.3 | v48.26,24.39 44.67,27.98 41.32,27.98 40.09,29.21 TP11.1
  Bottom 0.381: v48.26,24.39 54.87,17.78 K1.3
BATTERY  (via drill 0.38)
  Top 0.254: TP1.1 58.42,17.78 v69.85,29.21
  Bottom 0.254: v69.85,29.21 J1.1
  pour Top (no thermals): 76.2,74.93 68.58,67.31 44.45,67.31 43.18,68.58 43.18,71.12 49.53,77.47 74.93,77.47 76.2,76.2
BATTIN
  Top 0.254: R13.2 15.28,29.02 15.13,28.87 15.13,27.96 14.86,27.69 14.86,26.26 U1.30 | R15.2 16.55,30.99 R13.2 | R13.2 15.02,32.52 R6.2 | D5.3 66.04,36.56 K1.1
  Top 0.381: Q3.2 54.23,23.29 28.4,23.29 26.37,25.31 26.37,31.22 28.09,32.94 28.09,34.12 27.73,34.47 21.34,34.47 20.87,33.99 20.87,33.35 R15.2
  pour Top (no thermals): 66.04,43.18 69.85,39.37 69.85,37.85 64.24,32.23 64.24,23.6 59.69,19.05 50.8,19.05 50.8,27.3 57.78,27.3 58.75,28.27 58.75,37.16 64.77,43.18
CPO  (via drill 0.38)
  Top 0.254: U1.1 10.79,19.29 C12.2
  Top 0.381: TP12.1 31.75,21.59 v30.48,20.32 | v7.62,16.51 7.62,18.15 C12.2
  Bottom 0.381: v30.48,20.32 26.67,16.51 v7.62,16.51
DCDC_VICOR  (via drill 0.38)
  Top 0.381: TP4.1 v34.29,17.78
  Bottom 0.381: v34.29,17.78 31.2,20.87 31.2,24.43 30.32,25.31 23.1,25.31 18,20.21 13.58,20.21 11.3,22.48 11.3,27.56 19.94,36.2 J3.2
  pour Top (no thermals): 17.78,64.77 19.05,63.5 38.1,63.5 41.91,67.31 41.91,72.39 40.64,73.66 22.86,73.66 17.78,68.58
DCDC_VICORPREMOS  (via drill 0.38)
  Top 0.254: U1.7 14.88,18.19 14.04,17.34 14.04,15.97 13.71,15.65 13.71,13.38 14.32,12.78 R8.2 16.54,12.89 R9.2 16.54,11.99 17.15,11.38 17.15,9.11 R12.2 | D6.3 31.65,50.8
  Top 0.381: U1.7 14.91,19.51 14.91,20.18 16.27,21.54 v17.2,21.54 | v29.31,31.9 29.31,48.36 31.75,50.8 | 31.65,50.8 Q4.2
  Bottom 0.381: v17.2,21.54 17.71,21.54 28.07,31.9 v29.31,31.9
  pour Top (no thermals): 41.91,62.23 41.91,57.15 36.83,52.07 36.83,48.56 29.21,48.56 29.21,55.88 35.56,62.23
GATE1  (via drill 0.38)
  Top 0.254: C6.2 13.63,16.69 13.63,17.51 14.23,18.11 U1.6 | Q4.1 30.75,47.6 31.1,47.95 36.27,47.95 36.88,47.35 36.88,41.41 Q1.1
  Top 0.381: v16.35,23.12 16.58,22.89 14.23,20.55 U1.6 | TP9.1 v40.64,21.59 | v34.29,36.83 34.29,39.13 Q1.1
  Bottom 0.381: v16.35,23.12 17.47,23.12 31.18,36.83 v34.29,36.83 34.29,27.94 v40.64,21.59
GATE2  (via drill 0.36, 0.38)
  Top 0.254: C5.2 14.23,29.11 U1.31 | v37.62,47.36 37.62,47.35
  Top 0.381: C5.2 14.34,33.44 14.23,33.55 14.23,35.03 14.81,35.61 18.26,35.61 20.47,37.82 v27.89,37.82 | TP2.1 v45.72,29.21 | v46.99,36.83 46.99,38.1 48.26,39.37 | 48.26,39.37 48.3,39.41 Q2.1 48.57,38.51 51.4,35.68 51.4,33.18 52.11,32.47 54.61,32.47 Q3.1 | 48.26,39.37 48.26,44.55 47.09,45.72 39.24,45.72 37.62,47.35
  Bottom 0.254: 30.75,40.71 30.74,40.71
  Bottom 0.381: v27.89,37.82 27.89,37.87 30.74,40.71 | v45.72,29.21 45.72,35.56 v46.99,36.83 | v37.62,47.36 37.39,47.36 30.75,40.71
GLVMS
  Top 0.254: R2.2 D2.A 87.17,15.54 J2.B
GND  (via drill 0.36, 0.38)
  Top 0.254: C11.2 21.58,15.75 | 21.58,15.75 C13.2 20.1,15.7 R11.1 | 21.58,15.75 21.67,15.66 R3.1 22.44,13.97 v21.59,13.97 | D6.1 24.13,53.28 v24.13,53.34 | D5.1 74.26,25.4 v78.74,25.4 77.8,26.34 D4.1 77.8,27 78.74,27.94 79.25,27.94 80.01,28.7 80.01,29.96 C2.2 C3.2 78.22,40.16 C1.P$2 | R2.1 74.97,19.05 | 74.97,19.05 R1.1 | U1.35 11.63,29.39 v11.58,29.44 | U1.20 21.39,22.32 v19.86,20.8 20.09,20.58 U1.15 U1.14 U1.13 | C4.2 15.99,38.1 v16.51,38.1 | U1.20 21.42,26.27 21.42,26.85 23.26,28.69 C9.2 23.84,30.25 R17.1 25.65,32.8 26.36,32.8 27.09,33.53 C8.2 | U1.20 21.38,26.23 21.38,25.65 20.95,25.22 20.3,25.22 20.09,25.43 U1.22 U1.23 U1.24 | D8.1 D7.1 D17.1 24.68,10.01 v23.37,10.01 | v10.16,11.43 11.31,12.59 C10.1 C7.2 | 74.97,19.05 v78.74,19.05
  Top 0.381: TP6.1 44.45,25.4 v45.72,24.13
  pour Bottom (no thermals): 0,86.11 0,0 100.33,0 100.33,86.11
INTVDD  (via drill 0.38)
  Top 0.254: U1.16 U1.17 21.39,17.46 C11.1
  Top 0.381: TP3.1 31.88,24.26 v30.2,24.26 | v21.46,20.95 20.73,20.23 U1.16
  Bottom 0.381: v30.2,24.26 26.9,20.95 v21.46,20.95
N$1
  Top 0.254: C9.1 24.45,26.23 U1.19
N$2
  Top 0.254: C13.1 17.99,16.31 17.99,17.19 17.48,17.7 U1.11
N$3
  Top 0.254: U1.26 17.48,27.32 17.95,27.79 20.53,27.79 22.87,30.13 22.87,31.26 24.25,32.65 24.6,32.65 25.48,33.53 C8.1
N$4
  Top 0.254: R6.1 12.92,36.53 C4.1
N$5
  Top 0.254: D17.2 24.47,13.06 23.55,13.06 22.53,12.04 22.53,7.75 20.98,6.2 13.49,6.2 6.83,12.85 6.83,13.54 7.26,13.97 R22.1
N$6  (via drill 0.36)
  Top 0.254: R13.1 20.28,35.56 27.94,35.56 28.68,34.82 28.68,32.38 27.46,31.17 27.46,25.5 v28.63,24.33 | v26.8,22.55 25.88,21.64 25.88,17.83 27.2,16.51 v29.21,16.51 | v30.48,13.97 D8.2
  Bottom 0.254: v28.63,24.33 26.85,22.55 v26.8,22.55 | v29.21,16.51 30.48,15.24 v30.48,13.97
N$7
  Top 0.254: D7.2 26.38,13.82 23.29,13.82 21.74,12.27 21.74,8.97 20.4,7.62 R12.1
N$12
  Bottom 1.27: K1.2 52.07,44.45 52.07,56.44 XF1.2
  pour Top (no thermals): 50.8,60.96 50.8,57.96 50.88,57.89 44.32,57.89 43.81,58.39 43.81,61.01 44.35,61.54 50.22,61.54
N$18  (via drill 0.38)
  Top 0.381: v17.4,24.16 16.74,24.16 15.64,25.27 13.23,25.27 12.93,25.57 U1.33 | v49.15,41.53 49.15,41.92 R5.3
  Bottom 0.381: v17.4,24.16 17.45,24.16 34.38,41.1 48.72,41.1 v49.15,41.53
N$20  (via drill 0.38)
  Top 0.381: U1.34 12.31,26.21 12.31,25.44 13.32,24.43 v14.43,24.43 | v48.9,52.45 51.3,52.45 R5.4
  Bottom 0.381: v14.43,24.43 15.8,24.43 43.83,52.45 v48.9,52.45
N$22
  Top 0.254: R8.1 15.16,9.41 C7.1
N$23  (via drill 0.38)
  Top 0.254: R4.3 38.98,43.18 v38.1,43.18 | v14.28,23.04 14.28,22.94 12.94,21.6 U1.4
  Bottom 0.254: v38.1,43.18 36.66,41.74 33.95,41.74 15.25,23.04 v14.28,23.04
N$24  (via drill 0.38)
  Top 0.254: R14.1 16.68,16.68 16.18,17.18 U1.9
  Top 0.381: R10.2 20.1,11.16 19.31,11.96 19.31,13.71 v19.05,13.97 | v16.26,15.37 16.26,16.26 16.68,16.68
  Bottom 0.381: v19.05,13.97 17.65,13.97 v16.26,15.37
N$25
  Top 0.254: U1.10 16.84,17.77 17.58,17.03 17.58,13.12 R11.2 R10.1
N$26
  Top 0.254: U1.29 15.54,28.7 R7.2 16.5,29.21 17.18,29.89 19.51,29.89 R15.1
N$27
  Top 0.254: U1.28 16.18,27.65 R7.1 18.01,29.48 20.55,29.48 21.34,30.27 21.34,32.81 21.94,33.41 R16.2
N$28
  Top 0.254: U1.27 16.84,27.25 17.78,28.19 20.36,28.19 22.14,29.97 R17.2 22.14,31.5 24.04,33.4 R16.1
N$30
  pour Top (no thermals): 52.07,45.72 52.07,33.17 58.42,33.17 58.42,45.72
N$31  (via drill 0.38)
  Top 0.381: U1.3 12.29,22.77 v12.83,23.31 | v37.47,48.64 37.47,49.9 R4.4
  Bottom 0.381: v37.47,48.64 37.47,48.59 12.83,23.95 v12.83,23.31
N$33
  pour Top (no thermals): 37.03,32.99 46.08,32.99 46.08,40.41 47.4,40.41 47.4,45.31 41.15,45.31 41.15,42.34 37.03,42.34
OUT  (via drill 0.38)
  Top 0.254: TP7.1 35.56,27.94 v35.56,29.21 | v50.8,41.91 51.54,42.65 51.93,42.65 52.09,42.81 52.09,45.74 v53.34,46.99
  Bottom 0.254: v50.8,41.91 50.61,41.91 49.3,40.6 46.95,40.6 v35.56,29.21 | v53.34,46.99 57.58,51.23 XF2.4
  pour Top (no thermals): 52.07,60.96 52.07,58.42 53.34,57.15 67.31,57.15 74.93,49.53 80.01,49.53 80.01,74.93 78.74,76.2 68.58,66.04 57.15,66.04
OUTPREFUSE
  Top 0.254: C10.2 12.59,13.97 R22.2 9.74,16.82 C12.1 10.93,17.79 11.68,18.54 11.68,19.44 U1.2 11.63,24.31 10.98,24.96 U1.36 10.98,28.7 10.76,28.93 10.76,38.7 23.46,51.4 23.46,52.99 23.41,53.04 23.41,53.64 27.47,57.7 30.63,57.7 35.16,62.23 41.91,62.23 43.18,60.96 43.18,52.38 | C2.1 78.74,29.73 D4.3 | 42,52.38 43.18,52.38 | 43.18,52.38 R4.2
  pour Top (no thermals): 71.12,30.48 77.47,30.48 77.47,46.23 67.06,56.64 42.67,56.64 40.64,54.61 40.64,46.23 64.26,46.23 71.12,39.37
SOURCE1  (via drill 0.38)
  Top 0.254: C6.1 13.59,18.14 U1.5
  Top 0.381: v14.22,21.72 13.59,21.08 U1.5 | v31.75,33.02 33.26,34.53 Q1.3 | TP10.1 40.72,19.13 v27.41,19.13 | v12.4,18.2 12.4,17.05 C6.1
  Bottom 0.381: v14.22,21.72 14.83,22.33 17.7,22.33 28.39,33.02 v31.75,33.02 | v27.41,19.13 26.48,18.2 v12.4,18.2
  pour Top (no thermals): 36.4,47.32 31.95,47.32 31.95,43.87 29.9,43.87 29.9,32.36 36.58,32.36 36.58,38.05 32.56,38.05 32.56,40.18 36.6,40.18
SOURCE2  (via drill 0.38)
  Top 0.254: C5.1 13.59,28.46 U1.32
  Top 0.381: C5.1 12.72,29.1 12.72,27.86 v12.62,27.76 | Q2.3 45.03,30.99 30,30.99 v28.87,29.86 29.52,29.21 TP5.1
  Bottom 0.381: v12.62,27.76 12.62,24.78 11.84,23.99 11.84,22.7 13.8,20.74 17.78,20.74 26.89,29.86 v28.87,29.86
  pour Top (no thermals): 54.61,27.69 54.61,31.75 50.8,31.75 50.8,35.56 46.99,35.56 46.99,29.21 48.51,27.69
START
  Top 0.254: D3.A 76.67,22.55 R1.2 83.28,20.34 J2.C
UVF1
  Top 0.254: U1.8 15.54,18.2 15.15,17.82 R14.2 14.44,15.8 R9.1

### Text on the board
tPlace: S2 | SHDN! | G2 | INTVDD | OUT | GND | CPO | G1 | S1 | DCDC | BAT | DCDC | HyTech Racing / Power Switching Board rev4 / Designed by Steven Elias | OUT | BAT
tValues: DO NOT INTALL XF2 / UNLESS BYPASSING / ENTIRE CIRCUIT! | Power Switching Board rev4 / Designed by / Steven Elias